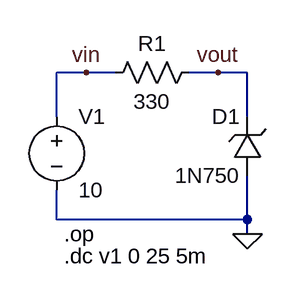
[diagram p0: schematic zener_characteristics_1n750.asc]
zener_characteristics_1n750.asc, the LTspice schematic file:
Version 4
SHEET 1 880 680
WIRE 80 -32 48 -32
WIRE 112 -32 80 -32
WIRE 224 -32 192 -32
WIRE 256 -32 224 -32
WIRE 48 16 48 -32
WIRE 256 16 256 -32
WIRE 48 128 48 96
WIRE 256 128 256 80
WIRE 256 128 48 128
WIRE 256 144 256 128
FLAG 256 144 0
FLAG 80 -32 vin
FLAG 224 -32 vout
SYMBOL zener 272 80 R180
WINDOW 0 24 64 Left 2
WINDOW 3 24 0 Left 2
SYMATTR InstName D1
SYMATTR Value 1N750
SYMATTR Description Diode
SYMATTR Type diode
SYMBOL voltage 48 0 R0
WINDOW 123 0 0 Left 0
WINDOW 39 0 0 Left 0
SYMATTR InstName V1
SYMATTR Value 10
SYMBOL res 208 -48 R90
WINDOW 0 0 56 VBottom 2
WINDOW 3 32 56 VTop 2
SYMATTR InstName R1
SYMATTR Value 330
TEXT 56 168 Left 2 !.dc v1 0 25 5m
TEXT 56 144 Left 2 !.op

The netlist it stands for:
* zener_characteristics_1n750.asc
D1 0 vout 1N750
V1 vin 0 10
R1 vout vin 330
.model D D
.lib standard.dio
.dc v1 0 25 5m
.op
.backanno
.end